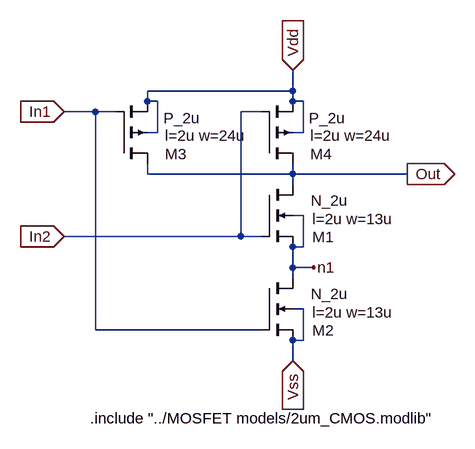
[diagram p0: schematic NAND2.asc]
NAND2.asc, the LTspice schematic file:
Version 4
SHEET 1 880 680
WIRE 192 48 192 16
WIRE 192 48 -32 48
WIRE -32 64 -32 48
WIRE -16 64 -32 64
WIRE 192 64 192 48
WIRE 208 64 192 64
WIRE -112 80 -160 80
WIRE -80 80 -112 80
WIRE 144 80 112 80
WIRE -16 112 -16 64
WIRE -16 112 -32 112
WIRE 208 112 208 64
WIRE 208 112 192 112
WIRE -32 176 -32 160
WIRE 192 176 192 160
WIRE 192 176 -32 176
WIRE 368 176 192 176
WIRE 192 192 192 176
WIRE 208 240 192 240
WIRE 112 272 112 80
WIRE 112 272 -160 272
WIRE 144 272 112 272
WIRE 208 288 208 240
WIRE 208 288 192 288
WIRE 192 320 192 288
WIRE 224 320 192 320
WIRE 192 336 192 320
WIRE 208 384 192 384
WIRE -112 416 -112 80
WIRE 144 416 -112 416
WIRE 208 432 208 384
WIRE 208 432 192 432
WIRE 192 464 192 432
FLAG 192 16 Vdd
IOPIN 192 16 In
FLAG 192 464 Vss
IOPIN 192 464 In
FLAG -160 80 In1
IOPIN -160 80 In
FLAG -160 272 In2
IOPIN -160 272 In
FLAG 368 176 Out
IOPIN 368 176 Out
FLAG 224 320 n1
SYMBOL nmos4 144 192 R0
WINDOW 0 78 81 Left 2
WINDOW 3 76 25 Left 2
WINDOW 123 78 53 Left 2
SYMATTR InstName M1
SYMATTR Value N_2u
SYMATTR Value2 l=2u w=13u
SYMBOL pmos4 144 160 M180
WINDOW 0 75 15 Left 2
WINDOW 3 73 70 Left 2
WINDOW 123 75 43 Left 2
SYMATTR InstName M4
SYMATTR Value P_2u
SYMATTR Value2 l=2u w=24u
SYMBOL pmos4 -80 160 M180
WINDOW 0 75 15 Left 2
WINDOW 3 73 70 Left 2
WINDOW 123 75 43 Left 2
SYMATTR InstName M3
SYMATTR Value P_2u
SYMATTR Value2 l=2u w=24u
SYMBOL nmos4 144 336 R0
WINDOW 0 78 81 Left 2
WINDOW 3 76 25 Left 2
WINDOW 123 78 53 Left 2
SYMATTR InstName M2
SYMATTR Value N_2u
SYMATTR Value2 l=2u w=13u
TEXT -120 552 Left 2 !.include "../MOSFET models/2um_CMOS.modlib"

The netlist it stands for:
* NAND2.asc
M1 Out In2 n1 n1 N_2u l=2u w=13u
M4 Out In2 Vdd Vdd P_2u l=2u w=24u
M3 Out In1 Vdd Vdd P_2u l=2u w=24u
M2 n1 In1 Vss Vss N_2u l=2u w=13u
.model NMOS NMOS
.model PMOS PMOS
.lib standard.mos
.include "../MOSFET models/2um_CMOS.modlib"
.backanno
.end